# Altium schematic sheet input5.SchDoc
size A3
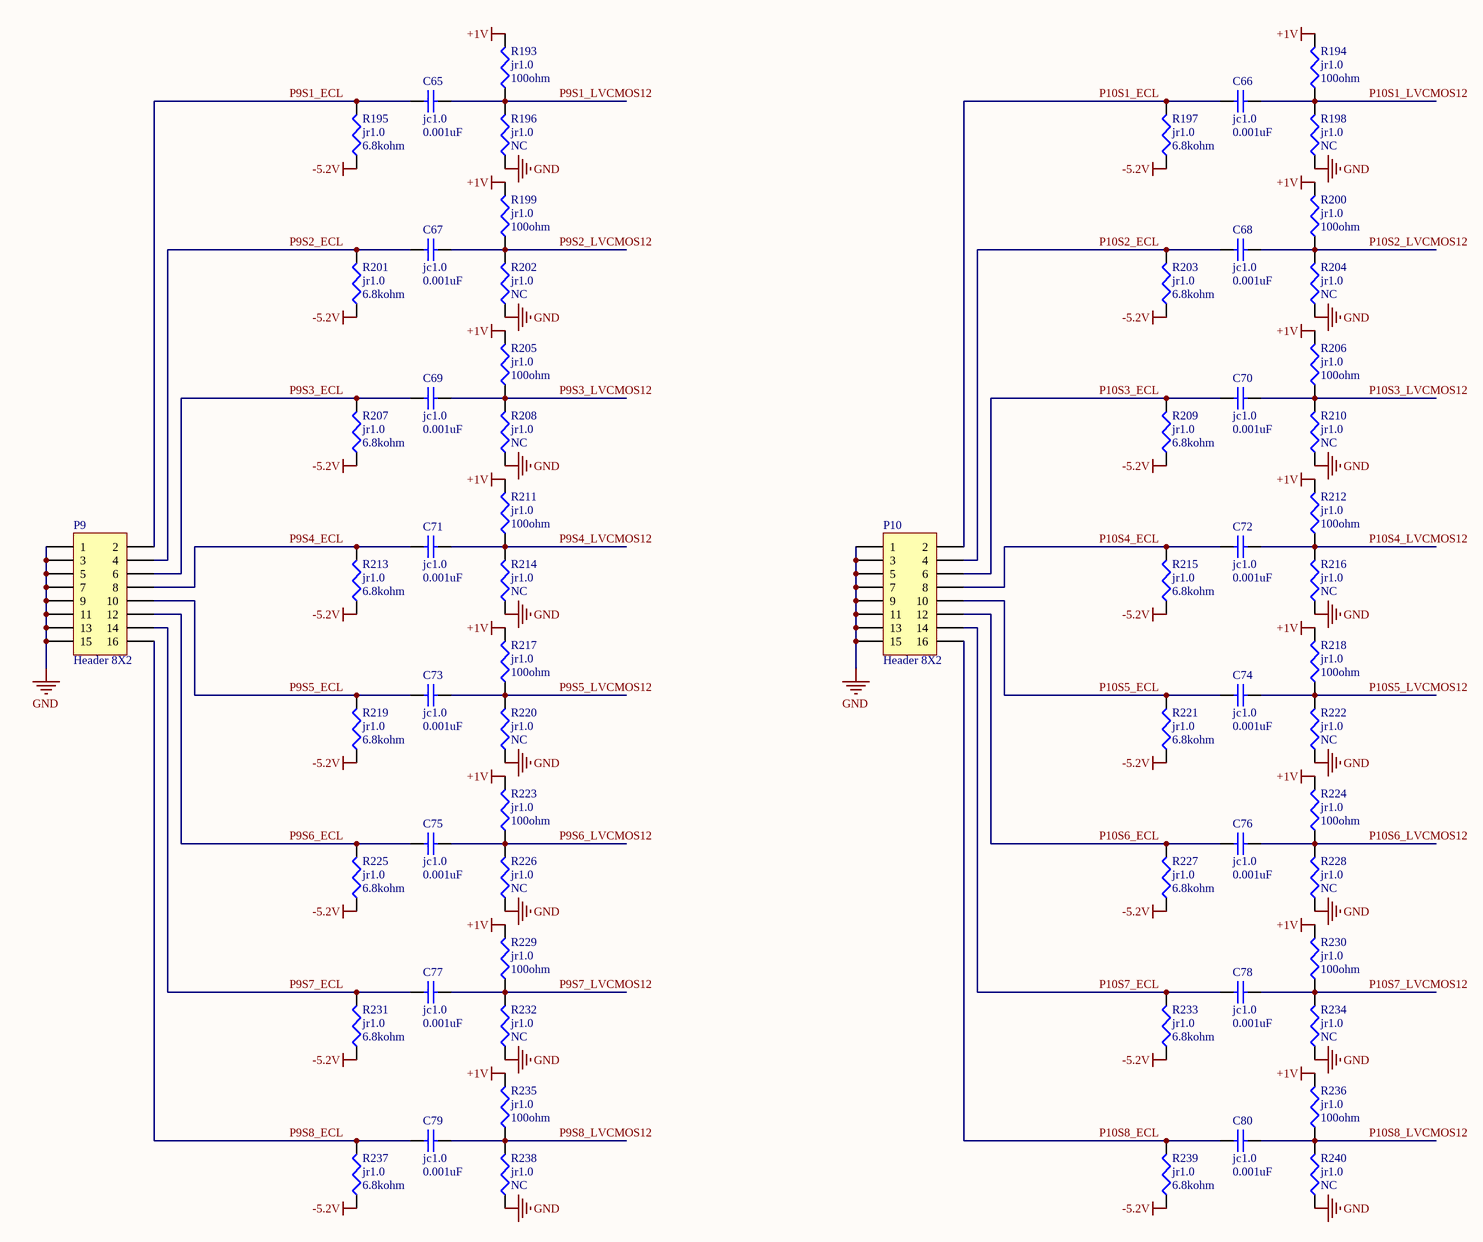
[diagram p0: input5.SchDoc]

## Parts
C65  jc1.0  value 0.001uF  [0402]
C66  jc1.0  value 0.001uF  [0402]
C67  jc1.0  value 0.001uF  [0402]
C68  jc1.0  value 0.001uF  [0402]
C69  jc1.0  value 0.001uF  [0402]
C70  jc1.0  value 0.001uF  [0402]
C71  jc1.0  value 0.001uF  [0402]
C72  jc1.0  value 0.001uF  [0402]
C73  jc1.0  value 0.001uF  [0402]
C74  jc1.0  value 0.001uF  [0402]
C75  jc1.0  value 0.001uF  [0402]
C76  jc1.0  value 0.001uF  [0402]
C77  jc1.0  value 0.001uF  [0402]
C78  jc1.0  value 0.001uF  [0402]
C79  jc1.0  value 0.001uF  [0402]
C80  jc1.0  value 0.001uF  [0402]
P9  Header 8X2  [HDR2X8]
P10  Header 8X2  [HDR2X8]
R193  jr1.0  value 100ohm  [0402]
R194  jr1.0  value 100ohm  [0402]
R195  jr1.0  value 6.8kohm  [0402]
R196  jr1.0  value NC  [0402]
R197  jr1.0  value 6.8kohm  [0402]
R198  jr1.0  value NC  [0402]
R199  jr1.0  value 100ohm  [0402]
R200  jr1.0  value 100ohm  [0402]
R201  jr1.0  value 6.8kohm  [0402]
R202  jr1.0  value NC  [0402]
R203  jr1.0  value 6.8kohm  [0402]
R204  jr1.0  value NC  [0402]
R205  jr1.0  value 100ohm  [0402]
R206  jr1.0  value 100ohm  [0402]
R207  jr1.0  value 6.8kohm  [0402]
R208  jr1.0  value NC  [0402]
R209  jr1.0  value 6.8kohm  [0402]
R210  jr1.0  value NC  [0402]
R211  jr1.0  value 100ohm  [0402]
R212  jr1.0  value 100ohm  [0402]
R213  jr1.0  value 6.8kohm  [0402]
R214  jr1.0  value NC  [0402]
R215  jr1.0  value 6.8kohm  [0402]
R216  jr1.0  value NC  [0402]
R217  jr1.0  value 100ohm  [0402]
R218  jr1.0  value 100ohm  [0402]
R219  jr1.0  value 6.8kohm  [0402]
R220  jr1.0  value NC  [0402]
R221  jr1.0  value 6.8kohm  [0402]
R222  jr1.0  value NC  [0402]
R223  jr1.0  value 100ohm  [0402]
R224  jr1.0  value 100ohm  [0402]
R225  jr1.0  value 6.8kohm  [0402]
R226  jr1.0  value NC  [0402]
R227  jr1.0  value 6.8kohm  [0402]
R228  jr1.0  value NC  [0402]
R229  jr1.0  value 100ohm  [0402]
R230  jr1.0  value 100ohm  [0402]
R231  jr1.0  value 6.8kohm  [0402]
R232  jr1.0  value NC  [0402]
R233  jr1.0  value 6.8kohm  [0402]
R234  jr1.0  value NC  [0402]
R235  jr1.0  value 100ohm  [0402]
R236  jr1.0  value 100ohm  [0402]
R237  jr1.0  value 6.8kohm  [0402]
R238  jr1.0  value NC  [0402]
R239  jr1.0  value 6.8kohm  [0402]
R240  jr1.0  value NC  [0402]

## Nets
+1V: R193.2 R194.2 R199.2 R200.2 R205.2 R206.2 R211.2 R212.2 R217.2 R218.2 R223.2 R224.2 R229.2 R230.2 R235.2 R236.2
-5.2V: R195.1 R197.1 R201.1 R203.1 R207.1 R209.1 R213.1 R215.1 R219.1 R221.1 R225.1 R227.1 R231.1 R233.1 R237.1 R239.1
GND: P9.1 P9.3 P9.5 P9.7 P9.9 P9.11 P9.13 P9.15 P10.1 P10.3 P10.5 P10.7 P10.9 P10.11 P10.13 P10.15 R196.1 R198.1 R202.1 R204.1 R208.1 R210.1 R214.1 R216.1 R220.1 R222.1 R226.1 R228.1 R232.1 R234.1 R238.1 R240.1
P9S1_ECL: C65.1 P9.2 R195.2
P9S1_LVCMOS12: C65.2 R193.1 R196.2
P9S2_ECL: C67.1 P9.4 R201.2
P9S2_LVCMOS12: C67.2 R199.1 R202.2
P9S3_ECL: C69.1 P9.6 R207.2
P9S3_LVCMOS12: C69.2 R205.1 R208.2
P9S4_ECL: C71.1 P9.8 R213.2
P9S4_LVCMOS12: C71.2 R211.1 R214.2
P9S5_ECL: C73.1 P9.10 R219.2
P9S5_LVCMOS12: C73.2 R217.1 R220.2
P9S6_ECL: C75.1 P9.12 R225.2
P9S6_LVCMOS12: C75.2 R223.1 R226.2
P9S7_ECL: C77.1 P9.14 R231.2
P9S7_LVCMOS12: C77.2 R229.1 R232.2
P9S8_ECL: C79.1 P9.16 R237.2
P9S8_LVCMOS12: C79.2 R235.1 R238.2
P10S1_ECL: C66.1 P10.2 R197.2
P10S1_LVCMOS12: C66.2 R194.1 R198.2
P10S2_ECL: C68.1 P10.4 R203.2
P10S2_LVCMOS12: C68.2 R200.1 R204.2
P10S3_ECL: C70.1 P10.6 R209.2
P10S3_LVCMOS12: C70.2 R206.1 R210.2
P10S4_ECL: C72.1 P10.8 R215.2
P10S4_LVCMOS12: C72.2 R212.1 R216.2
P10S5_ECL: C74.1 P10.10 R221.2
P10S5_LVCMOS12: C74.2 R218.1 R222.2
P10S6_ECL: C76.1 P10.12 R227.2
P10S6_LVCMOS12: C76.2 R224.1 R228.2
P10S7_ECL: C78.1 P10.14 R233.2
P10S7_LVCMOS12: C78.2 R230.1 R234.2
P10S8_ECL: C80.1 P10.16 R239.2
P10S8_LVCMOS12: C80.2 R236.1 R240.2

## Library data of the parts
C65-C80 = Cap: Capacitor; Published: 8-Jun-2000; LatestRevisionDate: 17-Jul-2002; LatestRevisionNote: Re-released for DXP Platform.; PackageReference: RAD-0.3; Publisher: Altium Limited
P9 P10 = Header 8X2: Header, 8-Pin, Dual row; LatestRevisionDate: 17-Jul-2002; LatestRevisionNote: Re-released for DXP Platform.; Publisher: Altium Limited
R193-R240 = Res: Resistor; Published: 8-Jun-2000; LatestRevisionDate: 04-Mar-2005; LatestRevisionNote: PCB Footprint replaced.; PackageReference: J1-0603; Publisher: Altium Limited